# Altium schematic sheet InputMUX.SchDoc
size A4; SheetNumber: 2; SheetTotal: 6
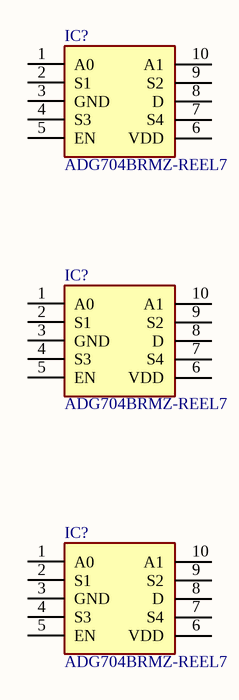
[diagram p0: InputMUX.SchDoc]

## Parts
(Parts that share a designator on the sheet are numbered #1, #2 ... from top to bottom, then left to right.)
IC?#1  ADG704BRMZ-REEL7  [SOP50P490X110-10N]
IC?#2  ADG704BRMZ-REEL7  [SOP50P490X110-10N]
IC?#3  ADG704BRMZ-REEL7  [SOP50P490X110-10N]

## Nets

Not connected (* = marked no-connect by the designer): IC?#1 1(A0) 2(S1) 3(GND) 4(S3) 5(EN) 6(VDD) 7(S4) 8(D) 9(S2) 10(A1); IC?#2 1(A0) 2(S1) 3(GND) 4(S3) 5(EN) 6(VDD) 7(S4) 8(D) 9(S2) 10(A1); IC?#3 1(A0) 2(S1) 3(GND) 4(S3) 5(EN) 6(VDD) 7(S4) 8(D) 9(S2) 10(A1)

## Library data of the parts
IC?#1-IC?#3 = ADG704BRMZ-REEL7: Integrated Circuit; Manufacturer_Name: Analog Devices; Datasheet Link: http://componentsearchengine.com/Datasheets/1/ADG704BRMZ-REEL7.pdf; Manufacturer_Part_Number: ADG704BRMZ-REEL7; Mouser Part Number: 584-ADG704BRMZ-R7; Mouser Price/Stock: https://www.mouser.co.uk/ProductDetail/Analog-Devices/ADG704BRMZ-REEL7?qs=BpaRKvA4VqF8DSGt0vw8%252Bg%3D%3D; Arrow Part Number: ADG704BRMZ-REEL7; Arrow Price/Stock: https://www.arrow.com/en/products/adg704brmz-reel7/analog-devices?region=nac